# Altium schematic sheet 1_PFC.SchDoc (part 2 of 4)
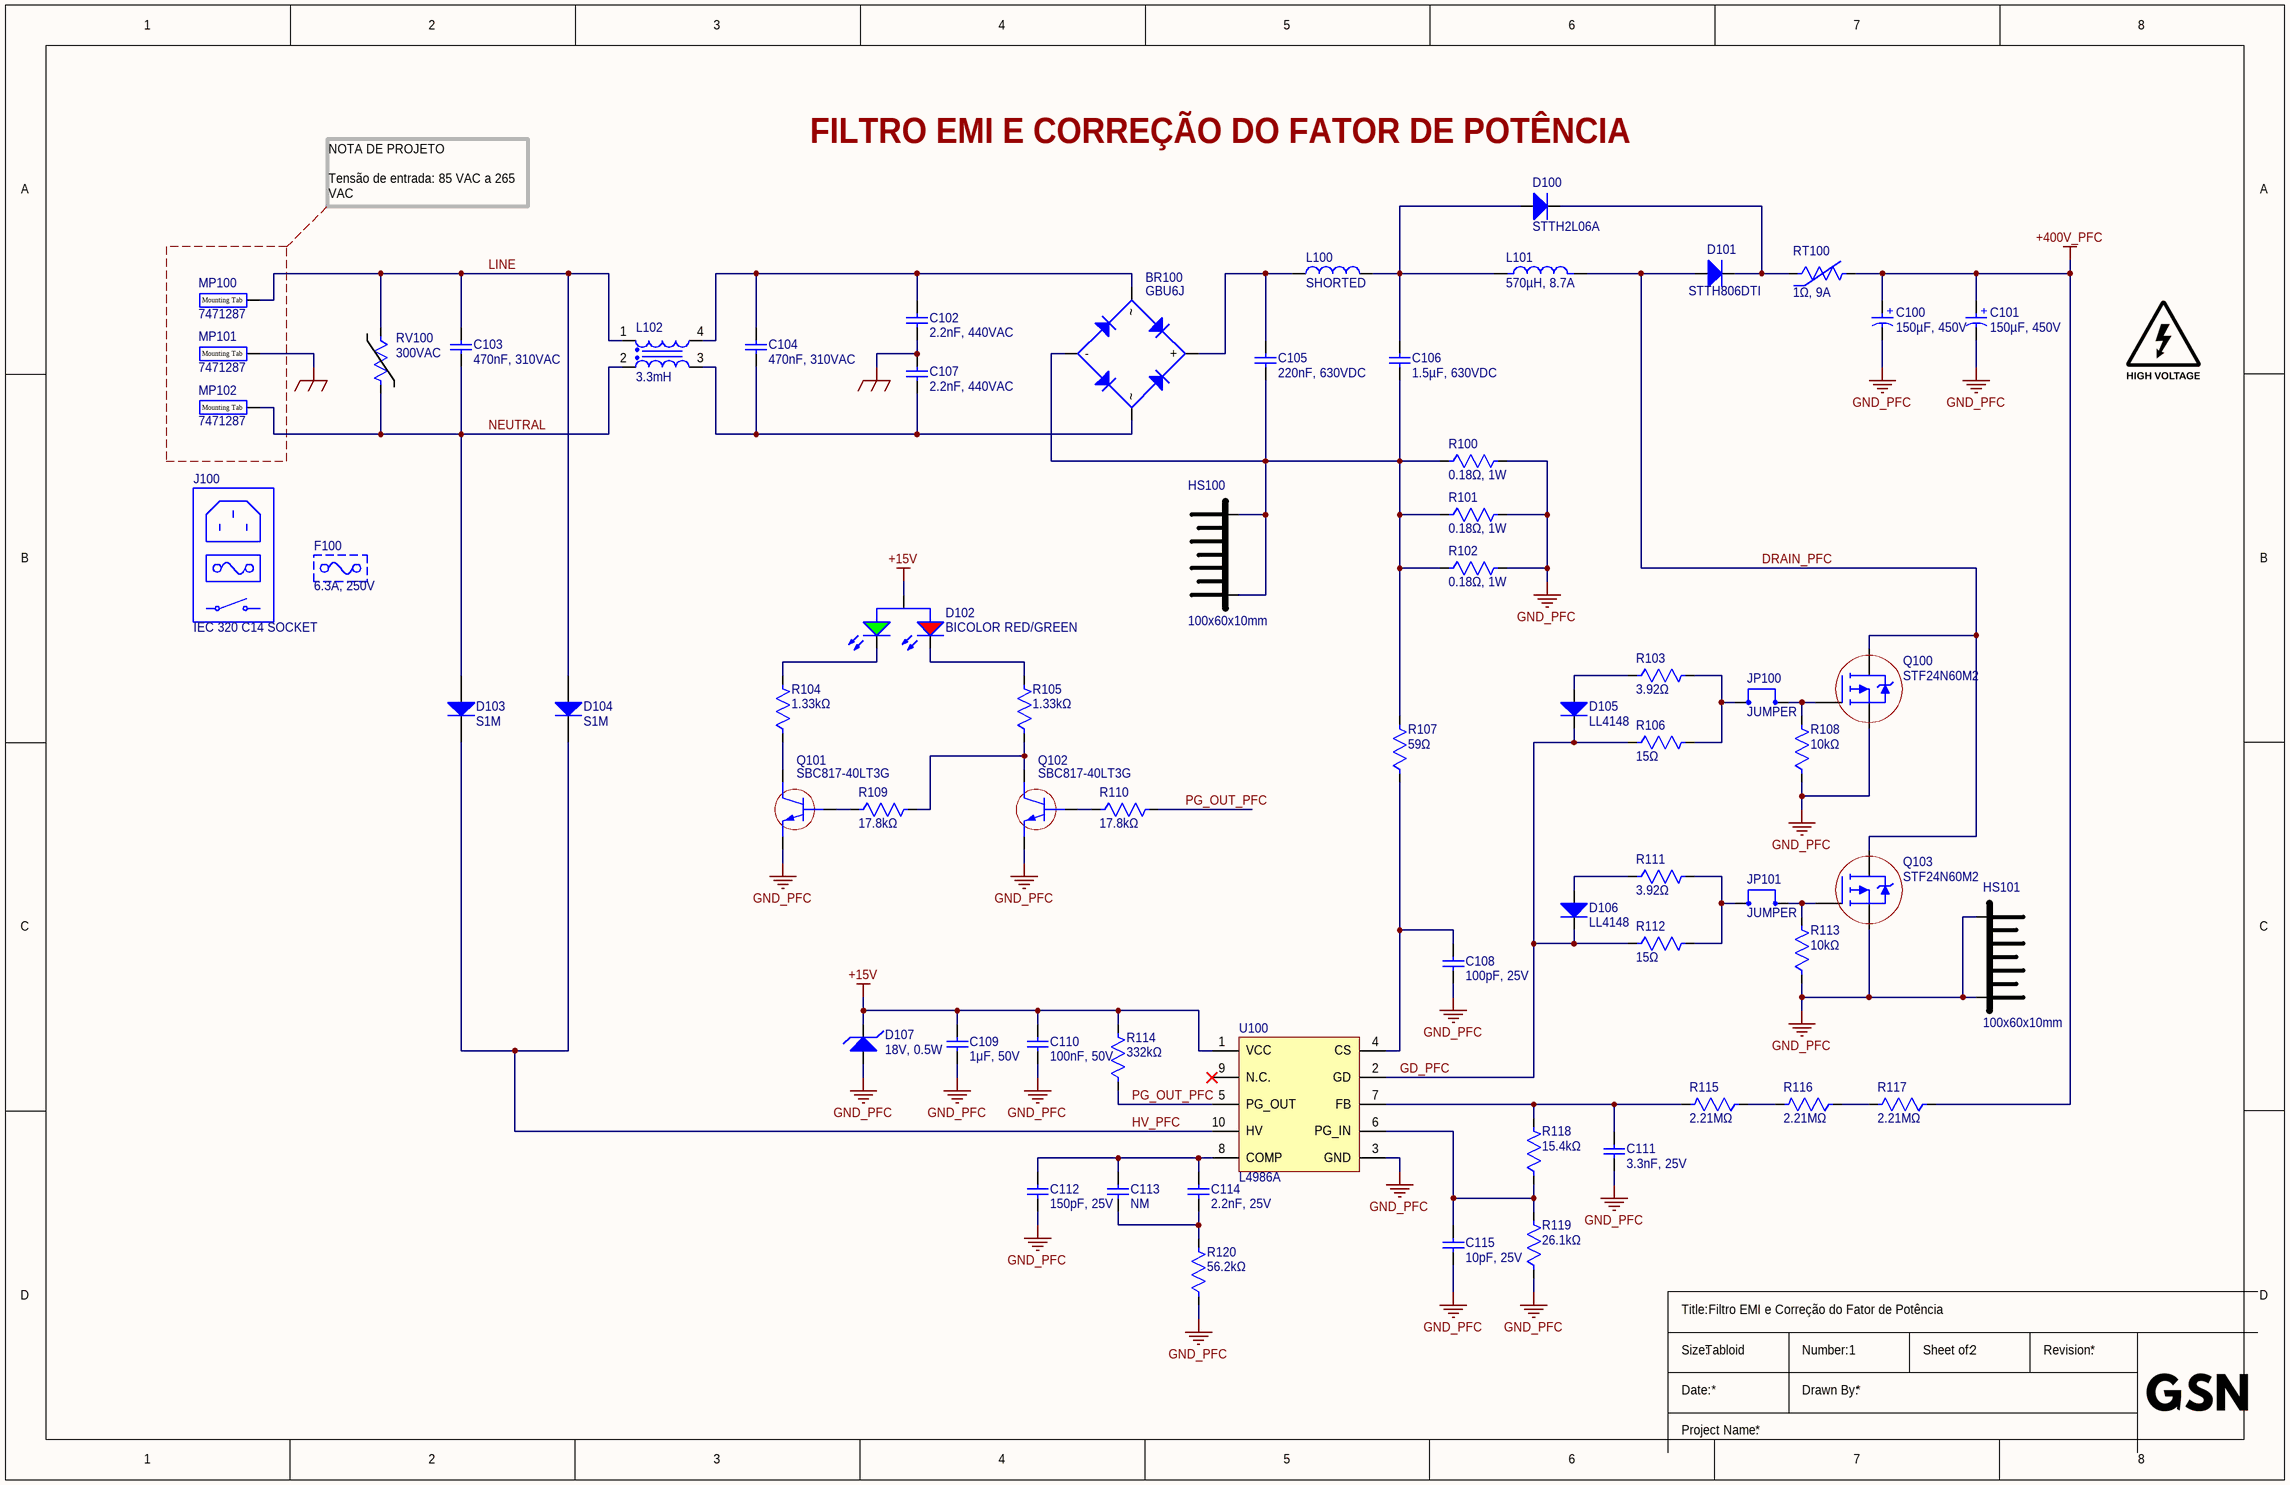
[diagram p1: 1_PFC.SchDoc]
## Library data of the parts
BR100 = GBU6J: BRIDGE RECT 1PHASE 600V 6A GBU; Manufacturer: onsemi; Manufacturer Lifecycle Status: ACTIVE; Value: 400pF; Element Configuration: Single; Forward Voltage: 1V; Max Forward Surge Current (Ifsm): 175A; Max Junction Temperature (Tj): 150°C; Max Power Dissipation: 12W; Max Reverse Leakage Current: 5µA; Number of Elements: 4; Supplier: DigiKey; Supplier Part Number: GBU6JFS-ND; Manufacturer Part Number: GBU6J; RoHS: Compliant; Category: Bridge Rectifier Diodes; Stock: 3548; Pricing: 1=2.02, 20=1.136, 100=0.8699, 500=0.6911, 1000=0.63359, 2000=0.58524, 5000=0.53293, 10000=0.53113 (USD); Average Rectified Current: 6A; Case/Package: SIP; China RoHS: Non-Compliant; Contact Plating: Tin; Current Rating: 6A; Export Control Classification Number (ECCN) Code: EAR99; Forward Current: 6A; Height: 20.83mm; Harmonized Tariff Schedule (HTS) Code: 8541.10.00.80; Introduction Date: 1999-01-01; Lead Free: Lead Free; Length: 22.3mm; Lifecycle Status: Production; Max Operating Temperature: 150°C; Max Output current: 6A; Max Repetitive Reverse Voltage (Vrrm): 600V; Max Surge Current: 175A; Min Breakdown Voltage: 600V; Min Operating Temperature: -55°C; Mounting Technology: Through Hole; Pins: 4; Number of Terminals: 4; Output Current: 6A; Peak Non-Repetitive Surge Current: 175A; Peak Reverse Current: 5µA; Power Dissipation: 12W; Radiation Hardening: No; REACH SVHC: No; Reverse Standoff Voltage: 600V; Reverse Voltage: 600V; Schedule B: 8541100080, 8541100080|8541100080|8541100080|8541100080|8541100080; Voltage Rating (DC): 600V; Weight: 5.4g; Width: 3.56mm; ComponentLink1URL: https://datasheet.octopart.com:443/GBU6J-onsemi-datasheet-166784474.pdf?src-supplier=Upverter; ComponentLink1Description: https://datasheet.octopart.com:443/GBU6J-onsemi-datasheet-166784474.pdf?src-supplier=Upverter; ComponentLink2URL: https://sigma.octopart.com:443/159494665/technical_drawing/onsemi-GBU6J.pdf?src-supplier=Upverter; ComponentLink2Description: https://sigma.octopart.com:443/159494665/technical_drawing/onsemi-GBU6J.pdf?src-supplier=Upverter; ComponentLink3URL: https://datasheet.octopart.com:443/GBU6J-ON-Semiconductor-datasheet-21133206.pdf?src-supplier=IHS; ComponentLink3Description: https://datasheet.octopart.com:443/GBU6J-ON-Semiconductor-datasheet-21133206.pdf?src-supplier=IHS; ComponentLink4URL: https://datasheet.octopart.com:443/GBU6J-onsemi-datasheet-180960912.pdf?src-supplier=IHS; ComponentLink4Description: https://datasheet.octopart.com:443/GBU6J-onsemi-datasheet-180960912.pdf?src-supplier=IHS; ComponentLink5URL: https://datasheet.octopart.com:443/GBU6J-ON-Semiconductor-datasheet-133511150.pdf?src-supplier=Master+Electronics; ComponentLink5Description: https://datasheet.octopart.com:443/GBU6J-ON-Semiconductor-datasheet-133511150.pdf?src-supplier=Master+Electronics; ComponentLink6URL: https://datasheet.octopart.com:443/GBU6J-ON-Semiconductor-datasheet-81100643.pdf?src-supplier=onsemi; ComponentLink6Description: https://datasheet.octopart.com:443/GBU6J-ON-Semiconductor-datasheet-81100643.pdf?src-supplier=onsemi; ComponentLink7URL: https://datasheet.octopart.com:443/GBU6J-ON-Semiconductor-datasheet-86697259.pdf?src-supplier=onsemi; ComponentLink7Description: https://datasheet.octopart.com:443/GBU6J-ON-Semiconductor-datasheet-86697259.pdf?src-supplier=onsemi; ComponentLink8URL: https://datasheet.octopart.com:443/GBU6J-Fairchild-datasheet-126805.pdf?src-supplier=Fairchild+Semiconductor; ComponentLink8Description: https://datasheet.octopart.com:443/GBU6J-Fairchild-datasheet-126805.pdf?src-supplier=Fairchild+Semiconductor; ComponentLink9URL: https://sigma.octopart.com:443/17352143/technical_drawing/Fairchild-Semiconductor-GBU6J.pdf?src-supplier=Fairchild+Semiconductor; ComponentLink9Description: https://sigma.octopart.com:443/17352143/technical_drawing/Fairchild-Semiconductor-GBU6J.pdf?src-supplier=Fairchild+Semiconductor; ComponentLink10URL: https://datasheet.octopart.com:443/GBU6J-Fairchild-Semiconductor-datasheet-12533422.pdf?src-supplier=Newark; ComponentLink10Description: https://datasheet.octopart.com:443/GBU6J-Fairchild-Semiconductor-datasheet-12533422.pdf?src-supplier=Newark; ComponentLink11URL: https://datasheet.octopart.com:443/GBU6J-onsemi-datasheet-181958985.pdf?src-supplier=Newark; ComponentLink11Description: https://datasheet.octopart.com:443/GBU6J-onsemi-datasheet-181958985.pdf?src-supplier=Newark; ComponentLink12URL: https://datasheet.octopart.com:443/GBU6J-Fairchild-datasheet-21080.pdf?src-supplier=Newark; ComponentLink12Description: https://datasheet.octopart.com:443/GBU6J-Fairchild-datasheet-21080.pdf?src-supplier=Newark; ComponentLink13URL: https://datasheet.octopart.com:443/GBU6J-Fairchild-Semiconductor-datasheet-67910529.pdf?src-supplier=Newark; ComponentLink13Description: https://datasheet.octopart.com:443/GBU6J-Fairchild-Semiconductor-datasheet-67910529.pdf?src-supplier=Newark; ComponentLink14URL: https://datasheet.octopart.com:443/GBU6J-ON-Semiconductor-datasheet-86690898.pdf?src-supplier=Farnell; ComponentLink14Description: https://datasheet.octopart.com:443/GBU6J-ON-Semiconductor-datasheet-86690898.pdf?src-supplier=Farnell; ComponentLink15URL: https://datasheet.octopart.com:443/GBU6J-Fairchild-Semiconductor-datasheet-17852642.pdf?src-supplier=Farnell; ComponentLink15Description: https://datasheet.octopart.com:443/GBU6J-Fairchild-Semiconductor-datasheet-17852642.pdf?src-supplier=Farnell; ComponentLink16URL: https://datasheet.octopart.com:443/GBU6J-Fairchild-Semiconductor-datasheet-16807792.pdf?src-supplier=Farnell; ComponentLink16Description: https://datasheet.octopart.com:443/GBU6J-Fairchild-Semiconductor-datasheet-16807792.pdf?src-supplier=Farnell; ComponentLink17URL: https://datasheet.octopart.com:443/GBU6J-onsemi-datasheet-165581311.pdf?src-supplier=TME; ComponentLink17Description: https://datasheet.octopart.com:443/GBU6J-onsemi-datasheet-165581311.pdf?src-supplier=TME; ComponentLink18URL: https://datasheet.octopart.com:443/GBU6J-ON-Semiconductor-datasheet-140794306.pdf?src-supplier=Future+Electronics; ComponentLink18Description: https://datasheet.octopart.com:443/GBU6J-ON-Semiconductor-datasheet-140794306.pdf?src-supplier=Future+Electronics; ComponentLink19URL: https://datasheet.octopart.com:443/GBU6J-Fairchild-Semiconductor-datasheet-14038890.pdf?src-supplier=iiiC; ComponentLink19Description: https://datasheet.octopart.com:443/GBU6J-Fairchild-Semiconductor-datasheet-14038890.pdf?src-supplier=iiiC; ComponentLink20URL: https://datasheet.octopart.com:443/GBU6J-Fairchild-Semiconductor-datasheet-68551039.pdf?src-supplier=element14+APAC; ComponentLink20Description: https://datasheet.octopart.com:443/GBU6J-Fairchild-Semiconductor-datasheet-68551039.pdf?src-supplier=element14+APAC; ComponentLink21URL: https://datasheet.octopart.com:443/GBU6J-Fairchild-Semiconductor-datasheet-68612053.pdf?src-supplier=element14+APAC; ComponentLink21Description: https://datasheet.octopart.com:443/GBU6J-Fairchild-Semiconductor-datasheet-68612053.pdf?src-supplier=element14+APAC; ComponentLink22URL: https://datasheet.octopart.com:443/GBU6J-Fairchild-Semiconductor-datasheet-78863373.pdf?src-supplier=element14+APAC; ComponentLink22Description: https://datasheet.octopart.com:443/GBU6J-Fairchild-Semiconductor-datasheet-78863373.pdf?src-supplier=element14+APAC; ComponentLink23URL: http://sigma.octopart.com:80/150611767/rohs_statement/ON-Semiconductor-GBU6J.pdf?src-supplier=Compliance+Statements; ComponentLink23Description: http://sigma.octopart.com:80/150611767/rohs_statement/ON-Semiconductor-GBU6J.pdf?src-supplier=Compliance+Statements; ComponentLink24URL: http://sigma.octopart.com:80/17352174/reach_statement/Fairchild-Semiconductor-GBU6J.pdf?src-supplier=Compliance+Statements; ComponentLink24Description: http://sigma.octopart.com:80/17352174/reach_statement/Fairchild-Semiconductor-GBU6J.pdf?src-supplier=Compliance+Statements; ComponentLink25URL: http://sigma.octopart.com:80/17352175/materials_sheet/Fairchild-Semiconductor-GBU6J.pdf?src-supplier=Compliance+Statements; ComponentLink25Description: http://sigma.octopart.com:80/17352175/materials_sheet/Fairchild-Semiconductor-GBU6J.pdf?src-supplier=Compliance+Statements; ComponentLink26URL: http://sigma.octopart.com:80/33179563/reach_statement/Fairchild-Semiconductor-GBU6J.pdf?src-supplier=Compliance+Statements; ComponentLink26Description: http://sigma.octopart.com:80/33179563/reach_statement/Fairchild-Semiconductor-GBU6J.pdf?src-supplier=Compliance+Statements; ComponentLink27URL: http://sigma.octopart.com:80/33179564/materials_sheet/Fairchild-Semiconductor-GBU6J.pdf?src-supplier=Compliance+Statements; ComponentLink27Description: http://sigma.octopart.com:80/33179564/materials_sheet/Fairchild-Semiconductor-GBU6J.pdf?src-supplier=Compliance+Statements; ComponentLink28URL: http://sigma.octopart.com:80/reach_statement/ON-Semiconductor-company-79.pdf?src-supplier=Compliance+Statements; ComponentLink28Description: http://sigma.octopart.com:80/reach_statement/ON-Semiconductor-company-79.pdf?src-supplier=Compliance+Statements; ComponentLink29URL: http://sigma.octopart.com:80/rohs_statement/Fairchild-Semiconductor-company-11.pdf?src-supplier=Compliance+Statements; ComponentLink29Description: http://sigma.octopart.com:80/rohs_statement/Fairchild-Semiconductor-company-11.pdf?src-supplier=Compliance+Statements; ComponentLink30URL: http://sigma.octopart.com:80/rohs_statement/Fairchild-Semiconductor-company-10.pdf?src-supplier=Compliance+Statements; ComponentLink30Description: http://sigma.octopart.com:80/rohs_statement/Fairchild-Semiconductor-company-10.pdf?src-supplier=Compliance+Statements; ComponentLink31URL: http://sigma.octopart.com:80/reach_statement/Fairchild-Semiconductor-company-9.pdf?src-supplier=Compliance+Statements; ComponentLink31Description: http://sigma.octopart.com:80/reach_statement/Fairchild-Semiconductor-company-9.pdf?src-supplier=Compliance+Statements; ComponentLink32URL: https://octopart.com:443/opatz8j6/c1?t=Y2wIxELd3Wvq9IWEVKKTsbdrjJ7Ggdcm4i7JSptPPw2OaGcdNAyHNaP5bgDn4HJSA5mnN8_a5kzX1s712JK3R8stqVIhLyJyItma3TYm28DTKvbjFTnp9bYk8A4AIXKJFpEh79XU9GUBxzcHZjptp9FPQWLpaKOSykZ5o1DVQXF0q0gaE6lgzVboydEWVrcN4tBadYht0FIpjxhPRkvcWqPgXENNVtgZuGQUgEPqcjuw72yI6g81z1w_15eUU2XXELnp3BdylIv2_9Km_Qs0osbZzRO3K02k_zQ3u8EGf4sSmYaHqZ_JhNL-pzDAUAmjd_hCwscb2tsZsK7vxo9hC2CTL1CcZYwx3w&src-supplier=Compliance+Statements; ComponentLink32Description: https://octopart.com:443/opatz8j6/c1?t=Y2wIxELd3Wvq9IWEVKKTsbdrjJ7Ggdcm4i7JSptPPw2OaGcdNAyHNaP5bgDn4HJSA5mnN8_a5kzX1s712JK3R8stqVIhLyJyItma3TYm28DTKvbjFTnp9bYk8A4AIXKJFpEh79XU9GUBxzcHZjptp9FPQWLpaKOSykZ5o1DVQXF0q0gaE6lgzVboydEWVrcN4tBadYht0FIpjxhPRkvcWqPgXENNVtgZuGQUgEPqcjuw72yI6g81z1w_15eUU2XXELnp3BdylIv2_9Km_Qs0osbZzRO3K02k_zQ3u8EGf4sSmYaHqZ_JhNL-pzDAUAmjd_hCwscb2tsZsK7vxo9hC2CTL1CcZYwx3w&src-supplier=Compliance+Statements; ComponentLink33URL: https://octopart.com:443/opatz8j6/c1?t=uBn0TeqP8mKnL0vu0TJMmksDArhA2xnjYHGUamFnwr0Lj9eHIe45ESEN0N09SN0W_BFgT4nWPUjYGWobgYUvNDrBCDNj55iUPKXM9JYlIPnVrBwaj6wnkAkpfDxE12ONBvxAFGcpA2XbXe3Nb2f-XI-nfFiswF2m2FowNrpNRvB6AKeZWoD9ll47nWlvgbebJo7YeJhCYeCrDHTRzSO7UGKpEOZsMMrM7qA5P6RiotoGMUrQrPOY8nKuTkPUKGEWd7UCPS9eXcAoSRVseLv4YBSMU9ZNnucNIvXCnlBboY69LxYHHH7v03oG_pEBnIu6Uvski6XAlJ3wmAIBVDV8r6g4l_d5L4-3&src-supplier=Compliance+Statements; ComponentLink33Description: https://octopart.com:443/opatz8j6/c1?t=uBn0TeqP8mKnL0vu0TJMmksDArhA2xnjYHGUamFnwr0Lj9eHIe45ESEN0N09SN0W_BFgT4nWPUjYGWobgYUvNDrBCDNj55iUPKXM9JYlIPnVrBwaj6wnkAkpfDxE12ONBvxAFGcpA2XbXe3Nb2f-XI-nfFiswF2m2FowNrpNRvB6AKeZWoD9ll47nWlvgbebJo7YeJhCYeCrDHTRzSO7UGKpEOZsMMrM7qA5P6RiotoGMUrQrPOY8nKuTkPUKGEWd7UCPS9eXcAoSRVseLv4YBSMU9ZNnucNIvXCnlBboY69LxYHHH7v03oG_pEBnIu6Uvski6XAlJ3wmAIBVDV8r6g4l_d5L4-3&src-supplier=Compliance+Statements
C100 C101 = 861011483006: WCAP-AIG8 Aluminum Electrolytic Capacitor, Snap-In, D22 x H50mm, 150µF, 450V; Manufacturer: Wurth Elektronik; Capacitance Tolerance: +/-20%; Dissipation Factor: 20%; Endurance: 2000h; Leakage Current: 1350µA; Ripple Current: 1.69A; Technical Reference: ANAN510151M450DSIC3B000; Manufacturer Part Number: 861011483006; Category: Aluminum Electrolytic Capacitors; Match Code: WCAP-AIG8; ComponentLink1Description: Website Link; ComponentLink1URL: https://www.we-online.com/redexpert/article/861011483006?ad; ComponentLink2Description: Datasheet Link; ComponentLink2URL: https://www.we-online.com/redexpert/spec/861011483006?ad; Mount: Through Hole; Operating Temperature Min: -25°C; Operating Temperature Max: 85°C; Packaging: Tray; Case/Size Code: D22 x H50mm; Height: 50mm; Diameter: 22mm; Capacitance: 150µF; Rated Voltage (DC): 450V
C102 C107 = VY2222M35Y5US63V7: CAP CER 2200PF 440VAC Y5U RADIAL; Manufacturer: Vishay; Dielectric Material: Ceramic; Lead/Base Style: Kinked; Lead Diameter: 600µm; Lead Length: 30mm; Tolerance: 20%; Voltage: 250V; Voltage Rating: 1kV; Voltage Rating (AC): 300V; Supplier: DigiKey; Supplier Part Number: BC2356-ND; Manufacturer Part Number: VY2222M35Y5US63V7; RoHS: Compliant; Category: Ceramic Capacitors; Stock: 12709; Pricing: 1=0.48, 10=0.288, 50=0.2152, 100=0.1928, 500=0.15486, 1000=0.14314, 3000=0.12868, 5000=0.12334 (USD); Value: 2.2nF; Case/Package: Radial; Composition: Ceramic; Contact Plating: Tin; Depth: 5mm; Diameter: 9mm; Dielectric: Y5U; Export Control Classification Number (ECCN) Code: EAR99; Height: 9mm; Height - Seated (Max): 13.0048mm; Harmonized Tariff Schedule (HTS) Code: 8532.23.00.60; Lead Free: Lead Free; Lead Pitch: 7.5mm; Length: 9mm; Lifecycle Status: Production; Material: Ceramic; Max Operating Temperature: 125°C; Min Operating Temperature: -40°C; Mounting Technology: PCB, Through Hole; Number of Terminals: 2; Packaging: Bulk; Radiation Hardening: No; REACH SVHC: Yes; Schedule B: 8532230060, 8532230060|8532230060, 8532230060|8532230060|8532230060, 8532230060|8532230060|8532230060|8532230060; Terminal Pitch: 7.5mm; Termination: Radial; Voltage Rating (DC): 1kV; Width: 5mm; ComponentLink1URL: https://datasheet.octopart.com:443/VY2222M35Y5US63V7-Vishay-datasheet-182139072.pdf?src-supplier=IHS; ComponentLink1Description: https://datasheet.octopart.com:443/VY2222M35Y5US63V7-Vishay-datasheet-182139072.pdf?src-supplier=IHS; ComponentLink2URL: https://datasheet.octopart.com:443/VY2222M35Y5US63V7-Vishay-datasheet-182137621.pdf?src-supplier=IHS; ComponentLink2Description: https://datasheet.octopart.com:443/VY2222M35Y5US63V7-Vishay-datasheet-182137621.pdf?src-supplier=IHS; ComponentLink3URL: https://datasheet.octopart.com:443/VY2222M35Y5US63V7-Vishay-BCcomponents-datasheet-138899136.pdf?src-supplier=Upverter; ComponentLink3Description: https://datasheet.octopart.com:443/VY2222M35Y5US63V7-Vishay-BCcomponents-datasheet-138899136.pdf?src-supplier=Upverter; ComponentLink4URL: https://datasheet.octopart.com:443/VY2222M35Y5US63V7-Vishay-datasheet-62321353.pdf?src-supplier=Farnell; ComponentLink4Description: https://datasheet.octopart.com:443/VY2222M35Y5US63V7-Vishay-datasheet-62321353.pdf?src-supplier=Farnell; ComponentLink5URL: https://datasheet.octopart.com:443/VY2222M35Y5US63V7-Vishay-datasheet-15070738.pdf?src-supplier=Farnell; ComponentLink5Description: https://datasheet.octopart.com:443/VY2222M35Y5US63V7-Vishay-datasheet-15070738.pdf?src-supplier=Farnell; ComponentLink6URL: https://datasheet.octopart.com:443/VY2222M35Y5US63V7-Vishay-datasheet-10380040.pdf?src-supplier=element14+APAC; ComponentLink6Description: https://datasheet.octopart.com:443/VY2222M35Y5US63V7-Vishay-datasheet-10380040.pdf?src-supplier=element14+APAC; ComponentLink7URL: https://datasheet.octopart.com:443/VY2222M35Y5US63V7-Vishay-datasheet-13530909.pdf?src-supplier=Future+Electronics; ComponentLink7Description: https://datasheet.octopart.com:443/VY2222M35Y5US63V7-Vishay-datasheet-13530909.pdf?src-supplier=Future+Electronics; ComponentLink8URL: https://datasheet.octopart.com:443/VY2222M35Y5US63V7-Vishay-datasheet-13402494.pdf?src-supplier=Future+Electronics; ComponentLink8Description: https://datasheet.octopart.com:443/VY2222M35Y5US63V7-Vishay-datasheet-13402494.pdf?src-supplier=Future+Electronics; ComponentLink9URL: https://datasheet.octopart.com:443/VY2222M35Y5US63V7-Vishay-datasheet-13168647.pdf?src-supplier=Future+Electronics; ComponentLink9Description: https://datasheet.octopart.com:443/VY2222M35Y5US63V7-Vishay-datasheet-13168647.pdf?src-supplier=Future+Electronics; ComponentLink10URL: https://datasheet.octopart.com:443/VY2222M35Y5US63V7-Vishay-datasheet-13030022.pdf?src-supplier=Future+Electronics; ComponentLink10Description: https://datasheet.octopart.com:443/VY2222M35Y5US63V7-Vishay-datasheet-13030022.pdf?src-supplier=Future+Electronics; ComponentLink11URL: https://datasheet.octopart.com:443/VY2222M35Y5US63V7-Vishay-datasheet-12553972.pdf?src-supplier=Future+Electronics; ComponentLink11Description: https://datasheet.octopart.com:443/VY2222M35Y5US63V7-Vishay-datasheet-12553972.pdf?src-supplier=Future+Electronics; ComponentLink12URL: https://datasheet.octopart.com:443/VY2222M35Y5US63V7-Vishay-datasheet-12524127.pdf?src-supplier=Future+Electronics; ComponentLink12Description: https://datasheet.octopart.com:443/VY2222M35Y5US63V7-Vishay-datasheet-12524127.pdf?src-supplier=Future+Electronics; ComponentLink13URL: https://datasheet.octopart.com:443/VY2222M35Y5US63V7-Vishay-datasheet-12510687.pdf?src-supplier=Future+Electronics; ComponentLink13Description: https://datasheet.octopart.com:443/VY2222M35Y5US63V7-Vishay-datasheet-12510687.pdf?src-supplier=Future+Electronics; ComponentLink14URL: https://datasheet.octopart.com:443/VY2222M35Y5US63V7-Vishay-datasheet-27584505.pdf?src-supplier=Future+Electronics; ComponentLink14Description: https://datasheet.octopart.com:443/VY2222M35Y5US63V7-Vishay-datasheet-27584505.pdf?src-supplier=Future+Electronics; ComponentLink15URL: https://datasheet.octopart.com:443/VY2222M35Y5US63V7-Vishay-datasheet-9918016.pdf?src-supplier=RS+(Formerly+Allied+Electronics); ComponentLink15Description: https://datasheet.octopart.com:443/VY2222M35Y5US63V7-Vishay-datasheet-9918016.pdf?src-supplier=RS+(Formerly+Allied+Electronics); ComponentLink16URL: http://sigma.octopart.com:80/rohs_statement/Vishay-company-15.pdf?src-supplier=Compliance+Statements; ComponentLink16Description: http://sigma.octopart.com:80/rohs_statement/Vishay-company-15.pdf?src-supplier=Compliance+Statements
C103 C104 = 890334025039CS: WCAP-FTXX Film Capacitor, THT, 18mm x 8mm x 14mm, 470nF, 310V; Manufacturer: Wurth Elektronik; Dissipation Factor @1kHz: 0.1%; Insulation Resistance: 21.28GΩ; Rate of Voltage Rise: 220V/µs; Safety Class: X2; Manufacturer Part Number: 890334025039CS; Category: Film Capacitors; Match Code: WCAP-FTXX; ComponentLink1Description: Website Link; ComponentLink1URL: https://www.we-online.com/redexpert/article/890334025039CS?ad; ComponentLink2Description: Datasheet Link; ComponentLink2URL: https://www.we-online.com/redexpert/spec/890334025039CS?ad; Mount: Through Hole; Min Operating Temperature: -40°C; Max Operating Temperature: 105°C; Packaging: Bulk; Length: 18mm; Width: 8mm; Height: 14mm; Application: Across the mains; Capacitance: 470nF; Lead Pitch: 15mm; Rated Voltage (AC): 310V
C105 = 890414025003CS: WCAP-FTXH THB X2-Capacitor, THT, L18 x W8.5 x H14.5mm, 220nF, 310V; Manufacturer: Wurth Elektronik; Dissipation Factor @1kHz: 0.1%; Insulation Resistance: 25GΩ; Pitch: 15mm; Rate of Voltage Rise: 400V/μs; Safety Class: X2; Manufacturer Part Number: 890414025003CS; Category: Film Capacitors; Match Code: WCAP-FTXH; ComponentLink1Description: Website Link; ComponentLink1URL: https://www.we-online.com/redexpert/article/890414025003CS?ad; ComponentLink2Description: Datasheet Link; ComponentLink2URL: https://www.we-online.com/redexpert/spec/890414025003CS?ad; Mount: Through Hole; Operating Temperature Min: -40°C; Operating Temperature Max: 110°C; Packaging: Carton; Length: 18mm; Width: 8.5mm; Height: 14.5mm; Application: Across the mains or in series with the mains; Capacitance: 220nF; Rated Voltage (AC): 310V
C106 = 890414026009CS: WCAP-FTXH THB X2-Capacitor, THT, L26.5 x W14.5 x H24.5mm, 1.5µF, 310V; Manufacturer: Wurth Elektronik; Dissipation Factor @1kHz: 0.3%; Insulation Resistance: 5GΩ; Pitch: 22.5mm; Rate of Voltage Rise: 200V/μs; Safety Class: X2; Manufacturer Part Number: 890414026009CS; Category: Film Capacitors; Match Code: WCAP-FTXH; ComponentLink1Description: Website Link; ComponentLink1URL: https://www.we-online.com/redexpert/article/890414026009CS?ad; ComponentLink2Description: Datasheet Link; ComponentLink2URL: https://www.we-online.com/redexpert/spec/890414026009CS?ad; Mount: Through Hole; Operating Temperature Min: -40°C; Operating Temperature Max: 110°C; Packaging: Carton; Length: 26.5mm; Width: 14.5mm; Height: 24.5mm; Application: Across the mains; Capacitance: 1.5µF; Rated Voltage (AC): 310V
C108 = 885012206053: WCAP-CSGP Multilayer Ceramic Chip Capacitor, General Purpose, size 0603, 100pF, 25V; Manufacturer: Wurth Elektronik; Case/Size Code: 0603; Capacitance Tolerance: +/-10%; Ceramic Type: X7R; Dissipation Factor: 3.5%; Insulation Resistance: 10GΩ; Technical Reference: X7R0603101K025DFCT10000; Manufacturer Part Number: 885012206053; Category: Multilayer Ceramic Chip Capacitors; Match Code: WCAP-CSGP; ComponentLink1Description: Website Link; ComponentLink1URL: https://www.we-online.com/redexpert/article/885012206053?ad; ComponentLink2Description: Datasheet Link; ComponentLink2URL: https://www.we-online.com/redexpert/spec/885012206053?ad; Mount: Surface Mount; Min Operating Temperature: -55°C; Max Operating Temperature: 125°C; Packaging: Tape and Reel; Length: 1.6mm; Width: 0.8mm; Height: 0.8mm; Capacitance: 100pF; Rated Voltage (DC): 25V
C109 = 885012206126: WCAP-CSGP Multilayer Ceramic Chip Capacitor, General Purpose, size 0603, 1μF, 50V; Manufacturer: Wurth Elektronik; Case/Size Code: 0603; Capacitance Tolerance: +/-10%; Ceramic Type: X7R; Dissipation Factor: 10%; Insulation Resistance: 0.5GΩ; Technical Reference: X7R0603105K050DFCT10000; Manufacturer Part Number: 885012206126; Category: Multilayer Ceramic Chip Capacitors; Match Code: WCAP-CSGP; ComponentLink1Description: Website Link; ComponentLink1URL: https://www.we-online.com/redexpert/article/885012206126?ad; ComponentLink2Description: Datasheet Link; ComponentLink2URL: https://www.we-online.com/redexpert/spec/885012206126?ad; Mount: Surface Mount; Min Operating Temperature: -55°C; Max Operating Temperature: 125°C; Packaging: Tape and Reel; Length: 1.6mm; Width: 0.8mm; Height: 0.8mm; Capacitance: 1μF; Rated Voltage (DC): 50V
C110 = 885012206095R: WCAP-CSGP Multilayer Ceramic Chip Capacitor, General Purpose, size 0603, 100nF, 50V; Manufacturer: Wurth Elektronik; Case/Size Code: 0603; Capacitance Tolerance: +/-10%; Ceramic Type: X7R; Dissipation Factor: 3%; Insulation Resistance: 5GΩ; Technical Reference: X7R0603104K050DFCT20000; Manufacturer Part Number: 885012206095R; Category: Multilayer Ceramic Chip Capacitors; Match Code: WCAP-CSGP; ComponentLink1Description: Website Link; ComponentLink1URL: https://www.we-online.com/redexpert/article/885012206095R?ad; ComponentLink2Description: Datasheet Link; ComponentLink2URL: https://www.we-online.com/redexpert/spec/885012206095R?ad; Mount: Surface Mount; Min Operating Temperature: -55°C; Max Operating Temperature: 125°C; Packaging: Tape and Reel; Length: 1.6mm; Width: 0.8mm; Height: 0.8mm; Capacitance: 100nF; Rated Voltage (DC): 50V
C111 = 885012206062: WCAP-CSGP Multilayer Ceramic Chip Capacitor, General Purpose, size 0603, 3.3nF, 25V; Manufacturer: Wurth Elektronik; Case/Size Code: 0603; Capacitance Tolerance: +/-10%; Ceramic Type: X7R; Dissipation Factor: 3.5%; Insulation Resistance: 10GΩ; Technical Reference: X7R0603332K025DFCT10000; Manufacturer Part Number: 885012206062; Category: Multilayer Ceramic Chip Capacitors; Match Code: WCAP-CSGP; ComponentLink1Description: Website Link; ComponentLink1URL: https://www.we-online.com/redexpert/article/885012206062?ad; ComponentLink2Description: Datasheet Link; ComponentLink2URL: https://www.we-online.com/redexpert/spec/885012206062?ad; Mount: Surface Mount; Min Operating Temperature: -55°C; Max Operating Temperature: 125°C; Packaging: Tape and Reel; Length: 1.6mm; Width: 0.8mm; Height: 0.8mm; Capacitance: 3.3nF; Rated Voltage (DC): 25V
C112 = 885012006039: WCAP-CSGP Multilayer Ceramic Chip Capacitor, General Purpose, size 0603, 150pF, 25V; Manufacturer: Wurth Elektronik; Case/Size Code: 0603; Capacitance Tolerance: +/-5%; Ceramic Type: NP0; Insulation Resistance: 10GΩ; Q Factor: 1000; Technical Reference: NP00603151J025DFCT10000; Manufacturer Part Number: 885012006039; Category: Multilayer Ceramic Chip Capacitors; Match Code: WCAP-CSGP; ComponentLink1Description: Website Link; ComponentLink1URL: https://www.we-online.com/redexpert/article/885012006039?ad; ComponentLink2Description: Datasheet Link; ComponentLink2URL: https://www.we-online.com/redexpert/spec/885012006039?ad; Mount: Surface Mount; Operating Temperature Min: -55°C; Operating Temperature Max: 125°C; Packaging: Tape and Reel; Length: 1.6mm; Width: 0.8mm; Height: 0.8mm; Capacitance: 150pF; Rated Voltage (DC): 25V
C113 = 885012106020: WCAP-CSGP Multilayer Ceramic Chip Capacitor, General Purpose, size 0603, 470nF, 25V; Manufacturer: Wurth Elektronik; Case/Size Code: 0603; Capacitance Tolerance: +/-20%; Ceramic Type: X5R; Dissipation Factor: 10%; Insulation Resistance: 1.1GΩ; Technical Reference: X5R0603474M025DFCT10000; Manufacturer Part Number: 885012106020; Category: Multilayer Ceramic Chip Capacitors; Match Code: WCAP-CSGP; ComponentLink1Description: Website Link; ComponentLink1URL: https://www.we-online.com/redexpert/article/885012106020?ad; ComponentLink2Description: Datasheet Link; ComponentLink2URL: https://www.we-online.com/redexpert/spec/885012106020?ad; Mount: Surface Mount; Min Operating Temperature: -55°C; Max Operating Temperature: 85°C; Packaging: Tape and Reel; Length: 1.6mm; Width: 0.8mm; Height: 0.8mm; Capacitance: 470nF; Rated Voltage (DC): 25V
C114 = 885012206061: WCAP-CSGP Multilayer Ceramic Chip Capacitor, General Purpose, size 0603, 2.2nF, 25V; Manufacturer: Wurth Elektronik; Case/Size Code: 0603; Capacitance Tolerance: +/-10%; Ceramic Type: X7R; Dissipation Factor: 3.5%; Insulation Resistance: 10GΩ; Technical Reference: X7R0603222K025DFCT10000; Manufacturer Part Number: 885012206061; Category: Multilayer Ceramic Chip Capacitors; Match Code: WCAP-CSGP; ComponentLink1Description: Website Link; ComponentLink1URL: https://www.we-online.com/redexpert/article/885012206061?ad; ComponentLink2Description: Datasheet Link; ComponentLink2URL: https://www.we-online.com/redexpert/spec/885012206061?ad; Mount: Surface Mount; Operating Temperature Min: -55°C; Operating Temperature Max: 125°C; Packaging: Tape and Reel; Length: 1.6mm; Width: 0.8mm; Height: 0.8mm; Capacitance: 2.2nF; Rated Voltage (DC): 25V
C115 = 885012006032: WCAP-CSGP Multilayer Ceramic Chip Capacitor, General Purpose, size 0603, 10pF, 25V; Manufacturer: Wurth Elektronik; Case/Size Code: 0603; Capacitance Tolerance: +/-5%; Ceramic Type: NP0; Insulation Resistance: 10GΩ; Q Factor: 600; Technical Reference: NP00603100J025DFCT10000; Manufacturer Part Number: 885012006032; Category: Multilayer Ceramic Chip Capacitors; Match Code: WCAP-CSGP; ComponentLink1Description: Website Link; ComponentLink1URL: https://www.we-online.com/redexpert/article/885012006032?ad; ComponentLink2Description: Datasheet Link; ComponentLink2URL: https://www.we-online.com/redexpert/spec/885012006032?ad; Mount: Surface Mount; Min Operating Temperature: -55°C; Max Operating Temperature: 125°C; Packaging: Tape and Reel; Length: 1.6mm; Width: 0.8mm; Height: 0.8mm; Capacitance: 10pF; Rated Voltage (DC): 25V
D100 = STTH2L06A: DIODE STANDARD 600V 2A SMA; Manufacturer: STMicroelectronics; Element Configuration: Single; Forward Voltage: 1.05V; Max Forward Surge Current (Ifsm): 35A; Max Junction Temperature (Tj): 175°C; Number of Elements: 1; Peak Reverse Current: 2µA; Recovery Time: 85ns; Supplier: DigiKey; Supplier Part Number: 497-3549-6-ND; Manufacturer Part Number: STTH2L06A; RoHS: Compliant; Category: Rectifier Diodes; Stock: 9756; Pricing: 1=0.56, 10=0.346, 100=0.2202, 500=0.16544, 1000=0.14776, 2000=0.13287 (USD); Average Rectified Current: 2A; Case/Package: SMA; China RoHS: Non-Compliant; Country of Origin: Mainland China; Current Rating: 2A; Export Control Classification Number (ECCN) Code: EAR99; Forward Current: 2A; Height: 2.03mm; Harmonized Tariff Schedule (HTS) Code: 8541.10.00.80; Introduction Date: 2004-09-07; Length: 4.6mm; Lifecycle Status: Production; Max Operating Temperature: 175°C; Max Output current: 2A; Max Repetitive Reverse Voltage (Vrrm): 600V; Max Reverse Voltage (DC): 600V; Max Surge Current: 35A; Min Operating Temperature: -65°C; Mounting Technology: Surface Mount; Pins: 2; Number of Terminals: 2; Output Current: 2A; Packaging: Tape and Reel; Peak Non-Repetitive Surge Current: 35A; Polarity: Standard; Radiation Hardening: No; REACH SVHC: No; Reverse Recovery Time: 85ns; Reverse Standoff Voltage: 600V; Reverse Voltage: 600V; Schedule B: 8541100080, 8541100080|8541100080|8541100080|8541100080|8541100080; Voltage Rating (DC): 600V; Width: 2.95mm; ComponentLink1URL: https://datasheet.octopart.com:443/STTH2L06A-STMicroelectronics-datasheet-12540759.pdf?src-supplier=Newark; ComponentLink1Description: https://datasheet.octopart.com:443/STTH2L06A-STMicroelectronics-datasheet-12540759.pdf?src-supplier=Newark; ComponentLink2URL: https://datasheet.octopart.com:443/STTH2L06A-STMicroelectronics-datasheet-10836161.pdf?src-supplier=Factory+Futures; ComponentLink2Description: https://datasheet.octopart.com:443/STTH2L06A-STMicroelectronics-datasheet-10836161.pdf?src-supplier=Factory+Futures; ComponentLink3URL: https://datasheet.octopart.com:443/STTH2L06A-STMicroelectronics-datasheet-8103793.pdf?src-supplier=Factory+Futures; ComponentLink3Description: https://datasheet.octopart.com:443/STTH2L06A-STMicroelectronics-datasheet-8103793.pdf?src-supplier=Factory+Futures; ComponentLink4URL: https://datasheet.octopart.com:443/STTH2L06A-STMicroelectronics-datasheet-14054138.pdf?src-supplier=iiiC; ComponentLink4Description: https://datasheet.octopart.com:443/STTH2L06A-STMicroelectronics-datasheet-14054138.pdf?src-supplier=iiiC; ComponentLink5URL: https://datasheet.octopart.com:443/STTH2L06A-STMicroelectronics-datasheet-66230.pdf?src-supplier=DigiKey; ComponentLink5Description: https://datasheet.octopart.com:443/STTH2L06A-STMicroelectronics-datasheet-66230.pdf?src-supplier=DigiKey
D101 = STTH806DTI: DIODE STD 600V 8A TO220AC INS; Manufacturer: STMicroelectronics; Element Configuration: Single; Forward Voltage: 2.4V; Max Forward Surge Current (Ifsm): 180A; Max Junction Temperature (Tj): 150°C; Number of Elements: 1; Peak Reverse Current: 10µA; Polarity: Standard; Recovery Time: 30ns; Supplier: DigiKey; Supplier Part Number: 497-3250-5-ND; Manufacturer Part Number: STTH806DTI; RoHS: Compliant; Category: Rectifier Diodes; Stock: 1037; Pricing: 1=2.08, 50=0.861, 100=0.8408, 500=0.78042, 1000=0.74288 (USD); Average Rectified Current: 8A; Case/Package: TO-220-2; China RoHS: Non-Compliant; Country of Origin: Mainland China; Current Rating: 8A; Export Control Classification Number (ECCN) Code: EAR99; Forward Current: 8A; Height: 9.3mm; Harmonized Tariff Schedule (HTS) Code: 8541.10.00.80; Introduction Date: 1980-01-04; Lead Free: Lead Free; Length: 10.4mm; Lifecycle Status: Production; Max Operating Temperature: 150°C; Max Output current: 8A; Max Repetitive Reverse Voltage (Vrrm): 600V; Max Reverse Voltage (DC): 600V; Max Surge Current: 180A; Min Operating Temperature: -65°C; Mounting Technology: Through Hole; Pins: 2; Number of Terminals: 2; Output Current: 8A; Peak Non-Repetitive Surge Current: 180A; Radiation Hardening: No; REACH SVHC: No; Reverse Recovery Time: 30ns; Reverse Standoff Voltage: 600V; Reverse Voltage: 600V; Voltage Rating (DC): 600V; Width: 4.6mm; ComponentLink1URL: https://datasheet.octopart.com:443/STTH806DTI-STMicroelectronics-datasheet-8805855.pdf?src-supplier=Newark; ComponentLink1Description: https://datasheet.octopart.com:443/STTH806DTI-STMicroelectronics-datasheet-8805855.pdf?src-supplier=Newark; ComponentLink2URL: https://datasheet.octopart.com:443/STTH806DTI-STMicroelectronics-datasheet-33008909.pdf?src-supplier=Farnell; ComponentLink2Description: https://datasheet.octopart.com:443/STTH806DTI-STMicroelectronics-datasheet-33008909.pdf?src-supplier=Farnell; ComponentLink3URL: https://datasheet.octopart.com:443/STTH806DTI-STMicroelectronics-datasheet-148320.pdf?src-supplier=Verical; ComponentLink3Description: https://datasheet.octopart.com:443/STTH806DTI-STMicroelectronics-datasheet-148320.pdf?src-supplier=Verical; ComponentLink4URL: https://datasheet.octopart.com:443/STTH806DTI-STMicroelectronics-datasheet-68141.pdf?src-supplier=Mouser; ComponentLink4Description: https://datasheet.octopart.com:443/STTH806DTI-STMicroelectronics-datasheet-68141.pdf?src-supplier=Mouser; ComponentLink5URL: https://datasheet.octopart.com:443/STTH806DTI-STMicroelectronics-datasheet-14054847.pdf?src-supplier=iiiC; ComponentLink5Description: https://datasheet.octopart.com:443/STTH806DTI-STMicroelectronics-datasheet-14054847.pdf?src-supplier=iiiC
D102 = SSL-LX3059IGW-CA: LED GREEN/RED DIFF T-3MM TRI T/H; Manufacturer: Lumex; Color: Green, Red; Forward Current: 30mA; Forward Voltage: 2.2V; Lens Style: Colorless, Diffused, Dome; Luminous Intensity: 30mcd; Number of Circuits: 1; Number of LEDs: 2; Power Dissipation: 105mW; Reverse Voltage: 5V; Shape: Round; Viewing Angle: 60°; Wavelength: 635nm; Supplier: DigiKey; Supplier Part Number: 67-2307-ND; Manufacturer Part Number: SSL-LX3059IGW-CA; RoHS: Compliant; Category: LEDs; Stock: 91547; Pricing: 1=0.53, 10=0.365, 100=0.2624, 500=0.21602, 1000=0.20076, 2000=0.18779, 5000=0.17358, 10000=0.16471, 25000=0.15504 (USD); Case/Package: Radial; China RoHS: Compliant; Country of Origin: Mainland China; Export Control Classification Number (ECCN) Code: EAR99; Height: 5mm; Harmonized Tariff Schedule (HTS) Code: 8541.40.20.00; Illumination Color: Green, Red; Introduction Date: 2001-01-30; Lead Free: Lead Free; Lifecycle Status: Production; Max Operating Temperature: 85°C; Min Operating Temperature: -40°C; Mounting Technology: Through Hole; Pins: 3; Number of Terminals: 3; Packaging: Bulk; REACH SVHC: Yes; Schedule B: 8541402000, 8541402000|8541402000, 8541402000|8541402000|8541402000, 8541402000|8541402000|8541402000|8541402000; Terminal Pitch: 2.54mm; ComponentLink1URL: https://datasheet.octopart.com:443/SSL-LX3059IGW-CA-Lumex-datasheet-158669.pdf?src-supplier=IHS; ComponentLink1Description: https://datasheet.octopart.com:443/SSL-LX3059IGW-CA-Lumex-datasheet-158669.pdf?src-supplier=IHS; ComponentLink2URL: https://datasheet.octopart.com:443/SSL-LX3059IGW-CA-Lumex-datasheet-12552074.pdf?src-supplier=Future+Electronics; ComponentLink2Description: https://datasheet.octopart.com:443/SSL-LX3059IGW-CA-Lumex-datasheet-12552074.pdf?src-supplier=Future+Electronics
D103 D104 = S1M: DIODE STANDARD 1000V 1A DO214AC; Manufacturer: onsemi; Manufacturer Lifecycle Status: ACTIVE; Value: 6.6pF; Element Configuration: Single; Forward Voltage: 1.1V; Max Forward Surge Current (Ifsm): 30A; Max Junction Temperature (Tj): 150°C; Max Power Dissipation: 1.4W; Max Repetitive Reverse Voltage (Vrrm): 1kV; Max Surge Current: 40A; Number of Elements: 1; Peak Reverse Current: 1µA; Recovery Time: 1.8µs; Supplier: DigiKey; Supplier Part Number: S1MFSCT-ND; Manufacturer Part Number: S1M; RoHS: Compliant; Category: Rectifier Diodes; Stock: 295300; Pricing: 1=0.23, 10=0.156, 100=0.1216, 500=0.08984, 1000=0.077, 2000=0.07091 (USD); Average Rectified Current: 1A; Case/Package: SMA; China RoHS: Non-Compliant; Contact Plating: Tin; Country of Origin: Mainland China; Current: 1A; Current Rating: 1A; Export Control Classification Number (ECCN) Code: EAR99; Forward Current: 1A; Height: 2.5mm; Harmonized Tariff Schedule (HTS) Code: 8541.10.00.80; Introduction Date: 1998-06-01; Lead Free: Lead Free; Length: 4.75mm; Lifecycle Status: Production; Max Operating Temperature: 150°C; Max Output current: 1A; Max Reverse Voltage (DC): 1kV; Min Operating Temperature: -55°C; Mounting Technology: Surface Mount; Pins: 2; Number of Terminals: 2; Output Current: 1A; Packaging: Cut Tape; Peak Non-Repetitive Surge Current: 30A; Polarity: Standard; Power Dissipation: 1.4W; Radiation Hardening: No; REACH SVHC: No; Reverse Recovery Time: 1.8µs; Reverse Standoff Voltage: 1kV; Reverse Voltage: 1kV; Schedule B: 8541100080, 8541100080|8541100080, 8541100080|8541100080|8541100080, 8541100080|8541100080|8541100080|8541100080; Termination: SMD/SMT; Voltage: 1kV; Voltage Rating (DC): 1kV; Width: 5.28mm; ComponentLink1URL: https://datasheet.octopart.com:443/S1M-ON-Semiconductor-datasheet-137256442.pdf?src-supplier=Upverter; ComponentLink1Description: https://datasheet.octopart.com:443/S1M-ON-Semiconductor-datasheet-137256442.pdf?src-supplier=Upverter; ComponentLink2URL: https://sigma.octopart.com:443/138897407/technical_drawing/ON-Semiconductor-S1M.pdf?src-supplier=Upverter; ComponentLink2Description: https://sigma.octopart.com:443/138897407/technical_drawing/ON-Semiconductor-S1M.pdf?src-supplier=Upverter; ComponentLink3URL: https://datasheet.octopart.com:443/S1M-ON-Semiconductor-datasheet-155242966.pdf?src-supplier=onsemi; ComponentLink3Description: https://datasheet.octopart.com:443/S1M-ON-Semiconductor-datasheet-155242966.pdf?src-supplier=onsemi; ComponentLink4URL: https://datasheet.octopart.com:443/S1M-ON-Semiconductor-datasheet-81638276.pdf?src-supplier=onsemi; ComponentLink4Description: https://datasheet.octopart.com:443/S1M-ON-Semiconductor-datasheet-81638276.pdf?src-supplier=onsemi; ComponentLink5URL: https://datasheet.octopart.com:443/S1M-ON-Semiconductor-datasheet-86698603.pdf?src-supplier=onsemi; ComponentLink5Description: https://datasheet.octopart.com:443/S1M-ON-Semiconductor-datasheet-86698603.pdf?src-supplier=onsemi; ComponentLink6URL: https://datasheet.octopart.com:443/S1M-ON-Semiconductor-datasheet-21199496.pdf?src-supplier=Future+Electronics; ComponentLink6Description: https://datasheet.octopart.com:443/S1M-ON-Semiconductor-datasheet-21199496.pdf?src-supplier=Future+Electronics; ComponentLink7URL: https://datasheet.octopart.com:443/S1M-Fairchild-Semiconductor-datasheet-42431463.pdf?src-supplier=IHS; ComponentLink7Description: https://datasheet.octopart.com:443/S1M-Fairchild-Semiconductor-datasheet-42431463.pdf?src-supplier=IHS; ComponentLink8URL: https://datasheet.octopart.com:443/S1M-onsemi-datasheet-180969538.pdf?src-supplier=IHS; ComponentLink8Description: https://datasheet.octopart.com:443/S1M-onsemi-datasheet-180969538.pdf?src-supplier=IHS; ComponentLink9URL: https://datasheet.octopart.com:443/S1M-onsemi-datasheet-181265944.pdf?src-supplier=IHS; ComponentLink9Description: https://datasheet.octopart.com:443/S1M-onsemi-datasheet-181265944.pdf?src-supplier=IHS; ComponentLink10URL: https://datasheet.octopart.com:443/S1M-ON-Semiconductor-datasheet-86692978.pdf?src-supplier=Farnell; ComponentLink10Description: https://datasheet.octopart.com:443/S1M-ON-Semiconductor-datasheet-86692978.pdf?src-supplier=Farnell; ComponentLink11URL: https://datasheet.octopart.com:443/S1M-Fairchild-Semiconductor-datasheet-68341913.pdf?src-supplier=Farnell; ComponentLink11Description: https://datasheet.octopart.com:443/S1M-Fairchild-Semiconductor-datasheet-68341913.pdf?src-supplier=Farnell; ComponentLink12URL: https://datasheet.octopart.com:443/S1M.-Fairchild-Semiconductor-datasheet-2355.pdf?src-supplier=Fairchild+Semiconductor; ComponentLink12Description: https://datasheet.octopart.com:443/S1M.-Fairchild-Semiconductor-datasheet-2355.pdf?src-supplier=Fairchild+Semiconductor; ComponentLink13URL: https://sigma.octopart.com:443/17345279/technical_drawing/Fairchild-Semiconductor-S1M..pdf?src-supplier=Fairchild+Semiconductor; ComponentLink13Description: https://sigma.octopart.com:443/17345279/technical_drawing/Fairchild-Semiconductor-S1M..pdf?src-supplier=Fairchild+Semiconductor; ComponentLink14URL: https://datasheet.octopart.com:443/S1M-Fairchild-Semiconductor-datasheet-67132006.pdf?src-supplier=element14+APAC; ComponentLink14Description: https://datasheet.octopart.com:443/S1M-Fairchild-Semiconductor-datasheet-67132006.pdf?src-supplier=element14+APAC; ComponentLink15URL: https://datasheet.octopart.com:443/S1M-Fairchild-Semiconductor-datasheet-68457125.pdf?src-supplier=element14+APAC; ComponentLink15Description: https://datasheet.octopart.com:443/S1M-Fairchild-Semiconductor-datasheet-68457125.pdf?src-supplier=element14+APAC; ComponentLink16URL: https://datasheet.octopart.com:443/S1M.-Fairchild-Semiconductor-datasheet-8621163.pdf?src-supplier=_legacy+Avnet; ComponentLink16Description: https://datasheet.octopart.com:443/S1M.-Fairchild-Semiconductor-datasheet-8621163.pdf?src-supplier=_legacy+Avnet; ComponentLink17URL: https://datasheet.octopart.com:443/S1M.-Fairchild-Semiconductor-datasheet-17703433.pdf?src-supplier=Jameco; ComponentLink17Description: https://datasheet.octopart.com:443/S1M.-Fairchild-Semiconductor-datasheet-17703433.pdf?src-supplier=Jameco; ComponentLink18URL: https://datasheet.octopart.com:443/S1M-ON-Semiconductor-datasheet-81455056.pdf?src-supplier=TME; ComponentLink18Description: https://datasheet.octopart.com:443/S1M-ON-Semiconductor-datasheet-81455056.pdf?src-supplier=TME; ComponentLink19URL: https://datasheet.octopart.com:443/S1M-Fairchild-Semiconductor-datasheet-67356299.pdf?src-supplier=Newark; ComponentLink19Description: https://datasheet.octopart.com:443/S1M-Fairchild-Semiconductor-datasheet-67356299.pdf?src-supplier=Newark; ComponentLink20URL: https://datasheet.octopart.com:443/S1M-Fairchild-Semiconductor-datasheet-67650218.pdf?src-supplier=Newark; ComponentLink20Description: https://datasheet.octopart.com:443/S1M-Fairchild-Semiconductor-datasheet-67650218.pdf?src-supplier=Newark; ComponentLink21URL: http://sigma.octopart.com:80/150631121/rohs_statement/ON-Semiconductor-S1M.pdf?src-supplier=Compliance+Statements; ComponentLink21Description: http://sigma.octopart.com:80/150631121/rohs_statement/ON-Semiconductor-S1M.pdf?src-supplier=Compliance+Statements; ComponentLink22URL: http://sigma.octopart.com:80/17356692/reach_statement/Fairchild-Semiconductor-S1M..pdf?src-supplier=Compliance+Statements; ComponentLink22Description: http://sigma.octopart.com:80/17356692/reach_statement/Fairchild-Semiconductor-S1M..pdf?src-supplier=Compliance+Statements; ComponentLink23URL: http://sigma.octopart.com:80/17356693/materials_sheet/Fairchild-Semiconductor-S1M..pdf?src-supplier=Compliance+Statements; ComponentLink23Description: http://sigma.octopart.com:80/17356693/materials_sheet/Fairchild-Semiconductor-S1M..pdf?src-supplier=Compliance+Statements; ComponentLink24URL: http://sigma.octopart.com:80/33320135/reach_statement/Fairchild-Semiconductor-S1M..pdf?src-supplier=Compliance+Statements; ComponentLink24Description: http://sigma.octopart.com:80/33320135/reach_statement/Fairchild-Semiconductor-S1M..pdf?src-supplier=Compliance+Statements; ComponentLink25URL: http://sigma.octopart.com:80/33320136/materials_sheet/Fairchild-Semiconductor-S1M..pdf?src-supplier=Compliance+Statements; ComponentLink25Description: http://sigma.octopart.com:80/33320136/materials_sheet/Fairchild-Semiconductor-S1M..pdf?src-supplier=Compliance+Statements; ComponentLink26URL: http://sigma.octopart.com:80/reach_statement/ON-Semiconductor-company-79.pdf?src-supplier=Compliance+Statements; ComponentLink26Description: http://sigma.octopart.com:80/reach_statement/ON-Semiconductor-company-79.pdf?src-supplier=Compliance+Statements; ComponentLink27URL: http://sigma.octopart.com:80/rohs_statement/Fairchild-Semiconductor-company-11.pdf?src-supplier=Compliance+Statements; ComponentLink27Description: http://sigma.octopart.com:80/rohs_statement/Fairchild-Semiconductor-company-11.pdf?src-supplier=Compliance+Statements; ComponentLink28URL: http://sigma.octopart.com:80/rohs_statement/Fairchild-Semiconductor-company-10.pdf?src-supplier=Compliance+Statements; ComponentLink28Description: http://sigma.octopart.com:80/rohs_statement/Fairchild-Semiconductor-company-10.pdf?src-supplier=Compliance+Statements; ComponentLink29URL: http://sigma.octopart.com:80/reach_statement/Fairchild-Semiconductor-company-9.pdf?src-supplier=Compliance+Statements; ComponentLink29Description: http://sigma.octopart.com:80/reach_statement/Fairchild-Semiconductor-company-9.pdf?src-supplier=Compliance+Statements; ComponentLink30URL: https://octopart.com:443/opatz8j6/c1?t=n0SYjiZlka3r_Whlk6gXIPX58mX80-n1vomPl2TG4z1fmHuDBzJKwyqg0bRS_4_XgLdcmSYjtJgP_S5mZQILugFSHa93LL7cl5mwZrLdnYtNflzAqzuffqGNZZyCt7vmMSprHK16RecS2jkpkmbcKzWpRC-zUDtILVzj4gQyF_6qaHjtw7EcDuvb_Pqugyx8-8PKuYTRhJBhClgZk4_j75mz1q3ION-T6ibt9jV_FR2Qv5awSqFahmOuSekWtuxMqhRyD7MQcT7sPZCY191pJxk_FLAcfSSI_usOZnCXK2S15LESivvIV5SYtc3Ge4IvssPd_cTjsfGelDwlt0s_lh60Q-SArnY&src-supplier=Compliance+Statements; ComponentLink30Description: https://octopart.com:443/opatz8j6/c1?t=n0SYjiZlka3r_Whlk6gXIPX58mX80-n1vomPl2TG4z1fmHuDBzJKwyqg0bRS_4_XgLdcmSYjtJgP_S5mZQILugFSHa93LL7cl5mwZrLdnYtNflzAqzuffqGNZZyCt7vmMSprHK16RecS2jkpkmbcKzWpRC-zUDtILVzj4gQyF_6qaHjtw7EcDuvb_Pqugyx8-8PKuYTRhJBhClgZk4_j75mz1q3ION-T6ibt9jV_FR2Qv5awSqFahmOuSekWtuxMqhRyD7MQcT7sPZCY191pJxk_FLAcfSSI_usOZnCXK2S15LESivvIV5SYtc3Ge4IvssPd_cTjsfGelDwlt0s_lh60Q-SArnY&src-supplier=Compliance+Statements; ComponentLink31URL: https://octopart.com:443/opatz8j6/c1?t=9fN0xKxbvStzNDh-gT9V40Na1GFOKEqKEBKH0IzsOCdv-WrCDdU7NVt0a5jZpiM1-aUJRxbFJKQDoYXMAClQF-f-1JqdenA_zdjQropmCM7beD1ITlapi5La6F33tE-IyjPnPcQIRL5uGwYRF9lpX15cfc3_OeTxqVXYipX20js4p8k2WjlpPeTkKjpvacNtXs9clp1R-cp7RgURPYMTP6YYwA3pmboRfav4WWRbmUlnCD1W-zMoPXKmI0MdEDtAmP_dGOGCyP1r-vjGLjO6lhbJ5P6FsJbgS3Y09FlgP2FWqkGjad36MZBYWWMK04h6aXLJYVEO4CTOUJN6AMYU8J3gUKidxQ&src-supplier=Compliance+Statements; ComponentLink31Description: https://octopart.com:443/opatz8j6/c1?t=9fN0xKxbvStzNDh-gT9V40Na1GFOKEqKEBKH0IzsOCdv-WrCDdU7NVt0a5jZpiM1-aUJRxbFJKQDoYXMAClQF-f-1JqdenA_zdjQropmCM7beD1ITlapi5La6F33tE-IyjPnPcQIRL5uGwYRF9lpX15cfc3_OeTxqVXYipX20js4p8k2WjlpPeTkKjpvacNtXs9clp1R-cp7RgURPYMTP6YYwA3pmboRfav4WWRbmUlnCD1W-zMoPXKmI0MdEDtAmP_dGOGCyP1r-vjGLjO6lhbJ5P6FsJbgS3Y09FlgP2FWqkGjad36MZBYWWMK04h6aXLJYVEO4CTOUJN6AMYU8J3gUKidxQ&src-supplier=Compliance+Statements